# EAGLE design micromouse_v2 (EAGLE 6.3)
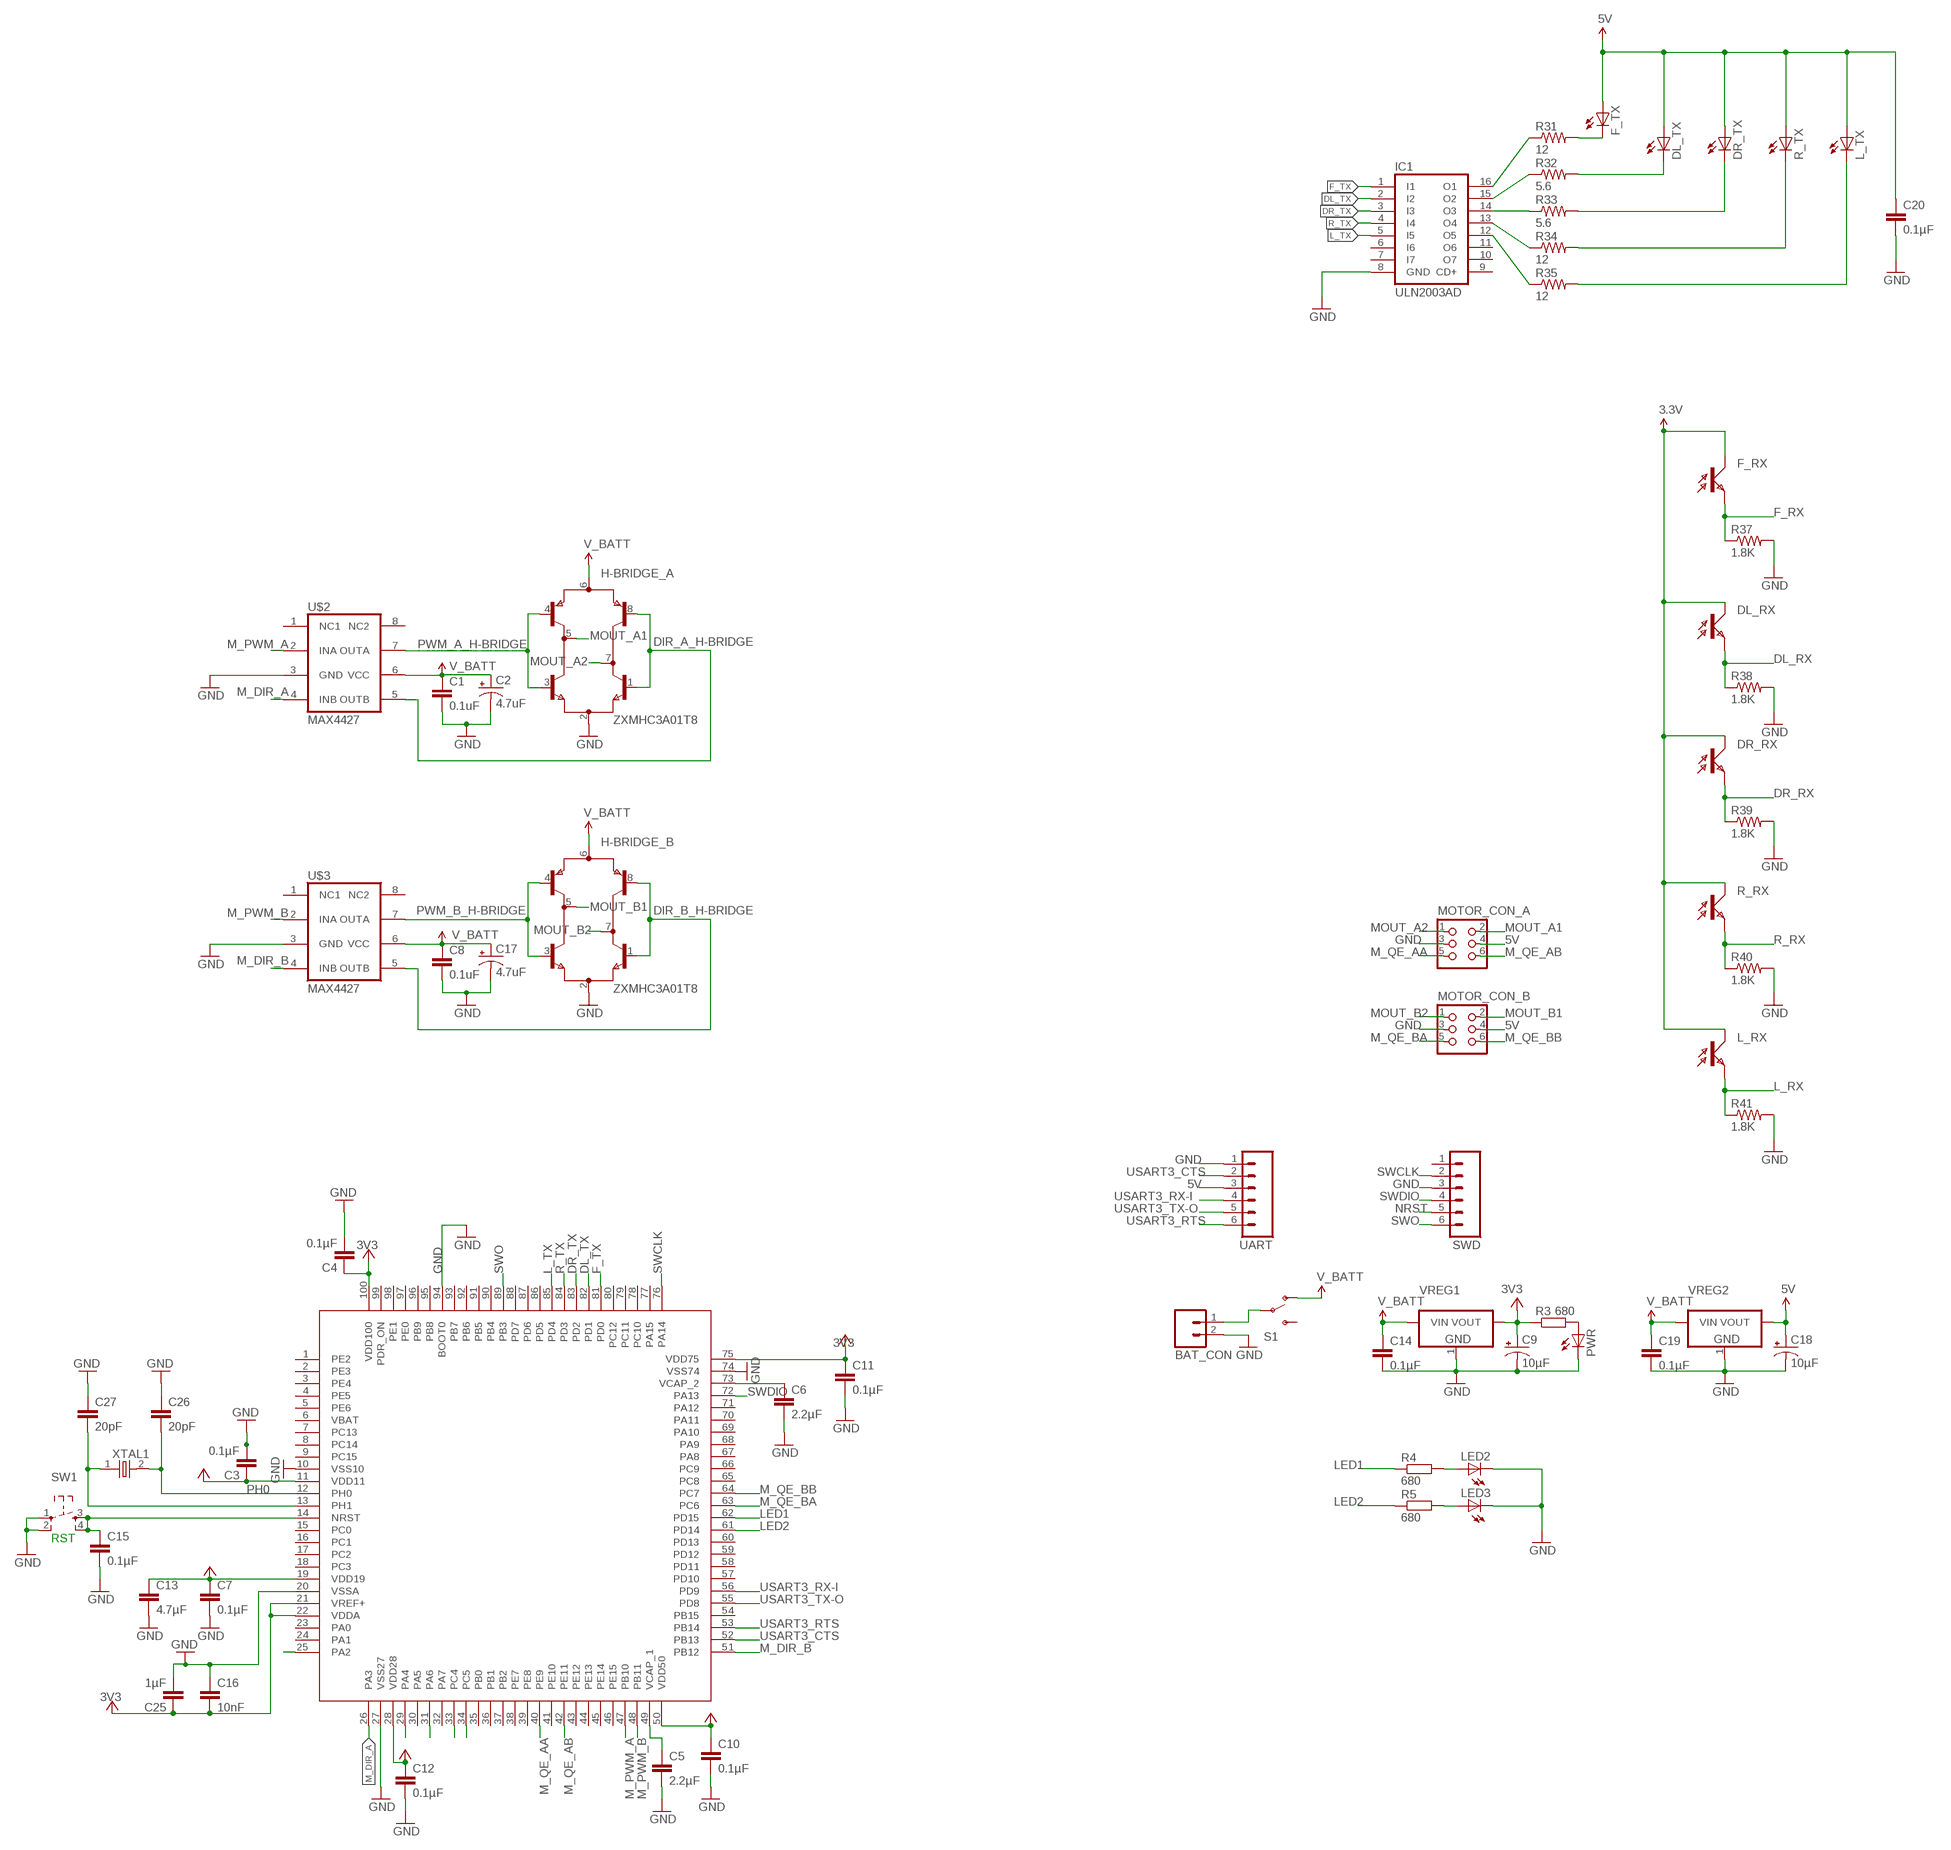
[diagram p0: schematic, sheet 1]

## Parts
BAT_CON  M02LOCK_LONGPADS  [1X02_LOCK_LONGPADS]
C1  0.1uF  CAP1206  [1206]
C2  4.7uF  CAP_POL1206-KIT  [EIA3216-KIT]
C3  0.1µF  CAP1206  [1206]
C4  0.1µF  CAP1206  [1206]
C5  2.2µF  CAP1206  [1206]
C6  2.2µF  CAP1206  [1206]
C7  0.1µF  CAP1206  [1206]
C8  0.1uF  CAP1206  [1206]
C9  10µF  CAP_POL1206  [EIA3216]
C10  0.1µF  CAP1206  [1206]
C11  0.1µF  CAP1206  [1206]
C12  0.1µF  CAP1206  [1206]
C13  4.7µF  CAP1206  [1206]
C14  0.1µF  CAP1206  [1206]
C15  0.1µF  CAP1206  [1206]
C16  10nF  CAP1206  [1206]
C17  4.7uF  CAP_POL1206-KIT  [EIA3216-KIT]
C18  10µF  CAP_POL1206  [EIA3216]
C19  0.1µF  CAP1206  [1206]
C20  0.1µF  CAP1206  [1206]
C25  1µF  CAP1206  [1206]
C26  20pF  CAP1206  [1206]
C27  20pF  CAP1206  [1206]
DL_RX  BPX81  [BPX81]
DL_TX  SFH482  [SFH482]
DR_RX  BPX81  [BPX81]
DR_TX  SFH482  [SFH482]
F_RX  BPX81  [BPX81]
F_TX  SFH482  [SFH482]
H-BRIDGE_A  ZXMHC3A01T8  H-BRIDGE  [SM8]
H-BRIDGE_B  ZXMHC3A01T8  H-BRIDGE  [SM8]
IC1  ULN2003AD  [SO16]
L_RX  BPX81  [BPX81]
L_TX  SFH482  [SFH482]
LED2  LED-FKIT-1206  [FKIT-LED-1206]
LED3  LED-FKIT-1206  [FKIT-LED-1206]
MOTOR_CON_A  CON_HEADER_2X03-PTH  [M2X3]
MOTOR_CON_B  CON_HEADER_2X03-PTH  [M2X3]
PWR  LED-FKIT-1206  [FKIT-LED-1206]
R3  680  RESISTOR-1206  [R1206]
R4  680  RESISTOR-1206  [R1206]
R5  680  RESISTOR-1206  [R1206]
R31  12  RESISTOR1206  [1206]
R32  5.6  RESISTOR1206  [1206]
R33  5.6  RESISTOR1206  [1206]
R34  12  RESISTOR1206  [1206]
R35  12  RESISTOR1206  [1206]
R37  1.8K  RESISTOR1206  [1206]
R38  1.8K  RESISTOR1206  [1206]
R39  1.8K  RESISTOR1206  [1206]
R40  1.8K  RESISTOR1206  [1206]
R41  1.8K  RESISTOR1206  [1206]
R_RX  BPX81  [BPX81]
R_TX  SFH482  [SFH482]
S1  SWITCH-SPDTPTH  [SWITCH-SPDT]
SW1  SW_TACT_4P  [SW_TACT_SMALL]
SWD  M06LOCK  [1X06_LOCK]
U$1  STM32F40X_QFP_PACKAGE  [TQFP-100-14X14MM]
U$2  MAX4427  [SO08]
U$3  MAX4427  [SO08]
UART  M06LOCK  [1X06_LOCK]
VREG1  VREG_3PINS-SOT-223  [SOT-223]
VREG2  VREG_3PINS-SOT-223  [SOT-223]
XTAL1  OSC-XTAL-HC-49U-SMD  [HC-49U]

## Nets
3.3V [low_pwr]: DL_RX.C DR_RX.C F_RX.C L_RX.C R_RX.C
3V3 [low_pwr]: C3.1 C4.1 C7.1 C9.A(+) C10.1 C11.1 C12.1 C13.1 C16.2 C25.1 R3.1 U$1.11(VDD11) U$1.19(VDD19) U$1.21(VREF+) U$1.22(VDDA) U$1.28(VDD28) U$1.50(VDD50) U$1.75(VDD75) U$1.100(VDD100) VREG1.2(VOUT) ; supply symbol labelled SUPPLY_+3V3
5V [low_pwr]: C18.A(+) C20.1 DL_TX.A DR_TX.A F_TX.A L_TX.A MOTOR_CON_A.4 MOTOR_CON_B.4 R_TX.A UART.3 VREG2.2(VOUT)
DIR_A_H-BRIDGE: H-BRIDGE_A.1(B3) H-BRIDGE_A.8(B4) U$2.5(OUTB)
DIR_B_H-BRIDGE: H-BRIDGE_B.1(B3) H-BRIDGE_B.8(B4) U$3.5(OUTB)
DL_RX: DL_RX.E R38.1 U$1.29(PA4)
DL_TX: IC1.2(I2) U$1.82(PD1)
DR_RX: DR_RX.E R39.1 U$1.33(PC4)
DR_TX: IC1.3(I3) U$1.83(PD2)
F_RX: F_RX.E R37.1 U$1.31(PA6)
F_TX: IC1.1(I1) U$1.81(PD0)
GND: BAT_CON.2 C1.2 C2.C(-) C3.2 C4.2 C5.2 C6.2 C7.2 C8.2 C9.C(-) C10.2 C11.2 C12.2 C13.2 C14.2 C15.2 C16.1 C17.C(-) C18.C(-) C19.2 C20.2 C25.2 C26.1 C27.1 H-BRIDGE_A.2(E2E3) H-BRIDGE_B.2(E2E3) IC1.8(GND) LED2.C LED3.C MOTOR_CON_A.3 MOTOR_CON_B.3 PWR.C R37.2 R38.2 R39.2 R40.2 R41.2 SW1.1 SW1.2 SWD.3 U$1.10(VSS10) U$1.20(VSSA) U$1.27(VSS27) U$1.74(VSS74) U$1.94(BOOT0) U$2.3(GND) U$3.3(GND) UART.1 VREG1.1(GND) VREG2.1(GND)
L_RX: L_RX.E R41.1 U$1.25(PA2)
L_TX: IC1.5(I5) U$1.85(PD4)
LED1: R4.1 U$1.62(PD15)
LED2: R5.1 U$1.61(PD14)
M_DIR_A: U$1.26(PA3) U$2.4(INB)
M_DIR_B: U$1.51(PB12) U$3.4(INB)
M_PWM_A: U$1.47(PB10) U$2.2(INA)
M_PWM_B: U$1.48(PB11) U$3.2(INA)
M_QE_AA: MOTOR_CON_A.5 U$1.40(PE9)
M_QE_AB: MOTOR_CON_A.6 U$1.42(PE11)
M_QE_BA: MOTOR_CON_B.5 U$1.63(PC6)
M_QE_BB: MOTOR_CON_B.6 U$1.64(PC7)
MOUT_A1 [PWR_Motors]: H-BRIDGE_A.5(C1C2) MOTOR_CON_A.2
MOUT_A2 [PWR_Motors]: H-BRIDGE_A.7(C3C4) MOTOR_CON_A.1
MOUT_B1 [PWR_Motors]: H-BRIDGE_B.5(C1C2) MOTOR_CON_B.2
MOUT_B2 [PWR_Motors]: H-BRIDGE_B.7(C3C4) MOTOR_CON_B.1
N$1: IC1.16(O1) R31.1
N$2: C6.1 U$1.73(VCAP_2)
N$3: C5.1 U$1.49(VCAP_1)
N$4: PWR.A R3.2
N$5: C27.2 U$1.13(PH1) XTAL1.1
N$6: LED2.A R4.2
N$7: LED3.A R5.2
N$10: IC1.15(O2) R32.1
N$11: IC1.14(O3) R33.1
N$12: IC1.13(O4) R34.1
N$13: IC1.12(O5) R35.1
N$14: F_TX.K(C) R31.2
N$15: DL_TX.K(C) R32.2
N$16 [Power]: BAT_CON.1 S1.2(P)
N$17: R34.2 R_TX.K(C)
N$18: L_TX.K(C) R35.2
N$19: DR_TX.K(C) R33.2
NRST: C15.1 SW1.3 SW1.4 SWD.5 U$1.14(NRST)
PH0: C26.2 U$1.12(PH0) XTAL1.2
PWM_A_H-BRIDGE: H-BRIDGE_A.3(B2) H-BRIDGE_A.4(B1) U$2.7(OUTA)
PWM_B_H-BRIDGE: H-BRIDGE_B.3(B2) H-BRIDGE_B.4(B1) U$3.7(OUTA)
R_RX: R40.1 R_RX.E U$1.34(PC5)
R_TX: IC1.4(I4) U$1.84(PD3)
SWCLK: SWD.2 U$1.76(PA14)
SWDIO: SWD.4 U$1.72(PA13)
SWO: SWD.6 U$1.89(PB3)
USART3_CTS: U$1.52(PB13) UART.2
USART3_RTS: U$1.53(PB14) UART.6
USART3_RX-I: U$1.56(PD9) UART.4
USART3_TX-O: U$1.55(PD8) UART.5
V_BATT [Power]: C1.1 C2.A(+) C8.1 C14.1 C17.A(+) C19.1 H-BRIDGE_A.6(E1E4) H-BRIDGE_B.6(E1E4) S1.1(O) U$2.6(VCC) U$3.6(VCC) VREG1.3(VIN) VREG2.3(VIN)
Unconnected: IC1.6(I6) IC1.7(I7) IC1.9(CD+) IC1.10(O7) IC1.11(O6) S1.3(S) SWD.1 U$1.1(PE2) U$1.2(PE3) U$1.3(PE4) U$1.4(PE5) U$1.5(PE6) U$1.6(VBAT) U$1.7(PC13) U$1.8(PC14) U$1.9(PC15) U$1.15(PC0) U$1.16(PC1) U$1.17(PC2) U$1.18(PC3) U$1.23(PA0) U$1.24(PA1) U$1.30(PA5) U$1.32(PA7) U$1.35(PB0) U$1.36(PB1) U$1.37(PB2) U$1.38(PE7) U$1.39(PE8) U$1.41(PE10) U$1.43(PE12) U$1.44(PE13) U$1.45(PE14) U$1.46(PE15) U$1.54(PB15) U$1.57(PD10) U$1.58(PD11) U$1.59(PD12) U$1.60(PD13) U$1.65(PC8) U$1.66(PC9) U$1.67(PA8) U$1.68(PA9) U$1.69(PA10) U$1.70(PA11) U$1.71(PA12) U$1.77(PA15) U$1.78(PC10) U$1.79(PC11) U$1.80(PC12) U$1.86(PD5) U$1.87(PD6) U$1.88(PD7) U$1.90(PB4) U$1.91(PB5) U$1.92(PB6) U$1.93(PB7) U$1.95(PB8) U$1.96(PB9) U$1.97(PE0) U$1.98(PE1) U$1.99(PDR_ON) U$2.1(NC1) U$2.8(NC2) U$3.1(NC1) U$3.8(NC2)

## Notes on the sheet
- RST

## Library data of the parts
BAT_CON = SparkFun-Connectors:M02: Header 2 Standard 2-pin 0.1" header. Use with straight break away headers (SKU : PRT-00116), right angle break away headers (PRT-00553), swiss pins (PRT-00743), machine pins (PRT-00117), and female headers (PRT-00115). Molex polarized connector foot print use with SKU : PRT-08233 with associated crimp pins and housings.
C1 C3-C8 C10-C16 C19 C20 C25-C27 = SparkFun-Passives:CAP: Capacitor Standard 0603 ceramic capacitor, and 0.1" leaded capacitor.
C2 C9 C17 C18 = SparkFun-Passives:CAP_POL: Capacitor Polarized These are standard SMD and PTH capacitors. Normally 10uF, 47uF, and 100uF in electrolytic and tantalum varieties. Always verify the external diameter of the through hole cap, it varies with capacity, voltage, and manufacturer. The EIA devices should be standard.
DL_RX DR_RX F_RX L_RX R_RX = opto-trans-siemens:BPX81: PHOTO TRANSISTOR; OC_FARNELL: unknown; OC_NEWARK: unknown
DL_TX DR_TX F_TX L_TX R_TX = led:SFH482: IR LED infrared emitting diode, Infineon
H-BRIDGE_A H-BRIDGE_B = zetex:H-BRIDGE: BRIDGE; OC_FARNELL: unknown; OC_NEWARK: unknown
IC1 = uln-udn:ULN2003A: DRIVER ARRAY
LED2 LED3 PWR = SparkFun-LED:LED: LEDs Standard schematic elements and footprints for 5mm, 3mm, 1206, and 0603 sized LEDs. 5mm - Spark Fun Electronics SKU : COM-00529 (and others)
MOTOR_CON_A MOTOR_CON_B = dp_devices:CON_HEADER_2X03
R3-R5 = dp_devices:RESISTOR
R31-R35 R37-R41 = SparkFun-Resistors:RESISTOR: Resistor Basic schematic elements and footprints for 0603, 1206, and PTH resistors.
S1 = SparkFun-Electromechanical:SWITCH-SPDT: SPST Switch Simple slide switch. Spark Fun Electronics SKU : COM-00102
SW1 = dp_devices:SW_TACT_4P
SWD UART = SparkFun-Connectors:M06: Header 6 Standard 6-pin 0.1" header. Use with straight break away headers (SKU : PRT-00116), right angle break away headers (PRT-00553), swiss pins (PRT-00743), machine pins (PRT-00117), and female headers (PRT-00115). Molex polarized connector foot print use with SKU : PRT-08094 with associated crimp pins and housings. NOTES ON THE VARIANTS LOCK and LOCK_LONGPADS... This footprint was designed to help hold the alignment of a through-hole component (i.e. 6-pin header) while soldering it into place. You may notice that each hole has been shifted either up or down by 0.005 of an inch from it's more standard position (which is a perfectly straight line). This slight alteration caused the pins (the squares in the middle) to touch the edges of the holes. Because they are alternating, it causes a "brace" to hold the component in place. 0.005 has proven to be the perfect amount of "off-center" position when using our standard breakaway headers. Although looks a little odd when you look at the bare footprint, once you have a header in there, the alteration is very hard to notice. Also, if you push a header all the way into place, it is covered up entirely on the bottom side. This idea of altering the position of holes to aid alignment will be further integrated into the Sparkfun Library for other footprints. It can help hold any component with 3 or more connection pins.
U$1 = STM32F4:STM32F40X_QFP_PACKAGE
U$2 U$3 = maxim:MAX4427
VREG1 VREG2 = dp_devices:VREG_3PINS: Various 3 pin voltage regulators in different packages Double check the right pinout for the right part
XTAL1 = dp_devices:OSC-XTAL

## Net classes
1 Power: width 0.762 mm, drill 0.508 mm, clearance 0.254 mm
2 PWR_Motors: width 1.016 mm, drill 0.762 mm, clearance 0.254 mm
3 low_pwr: width 0.254 mm, drill 0.381 mm, clearance 0.203 mm

## Board
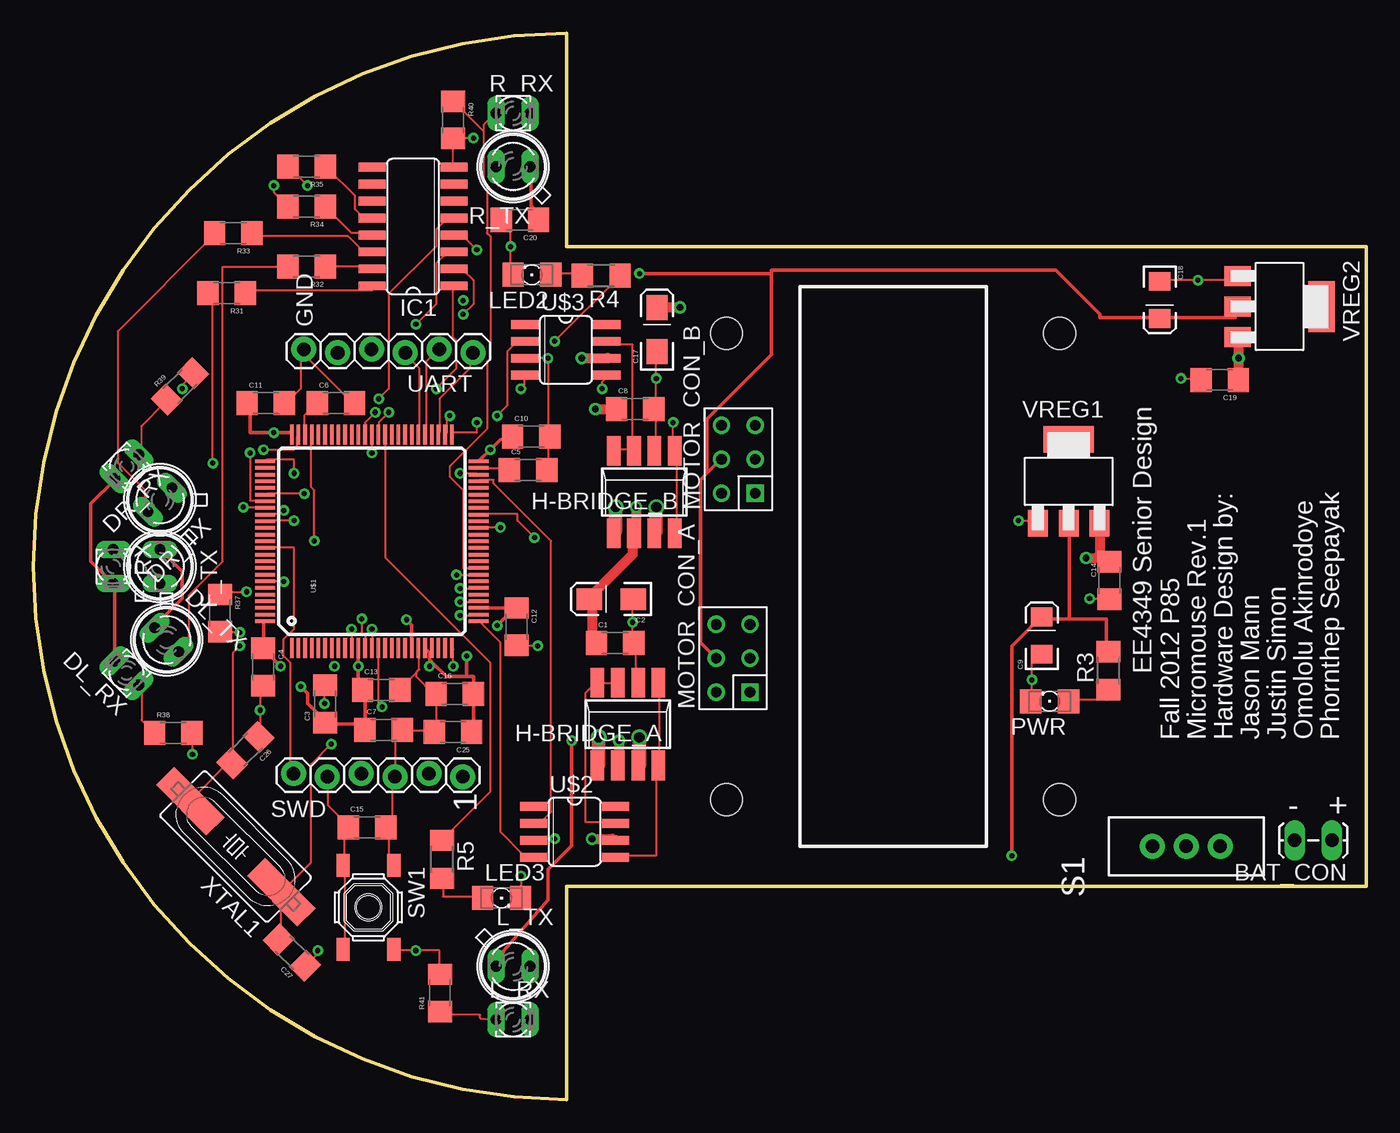
[diagram p1: board, top side]
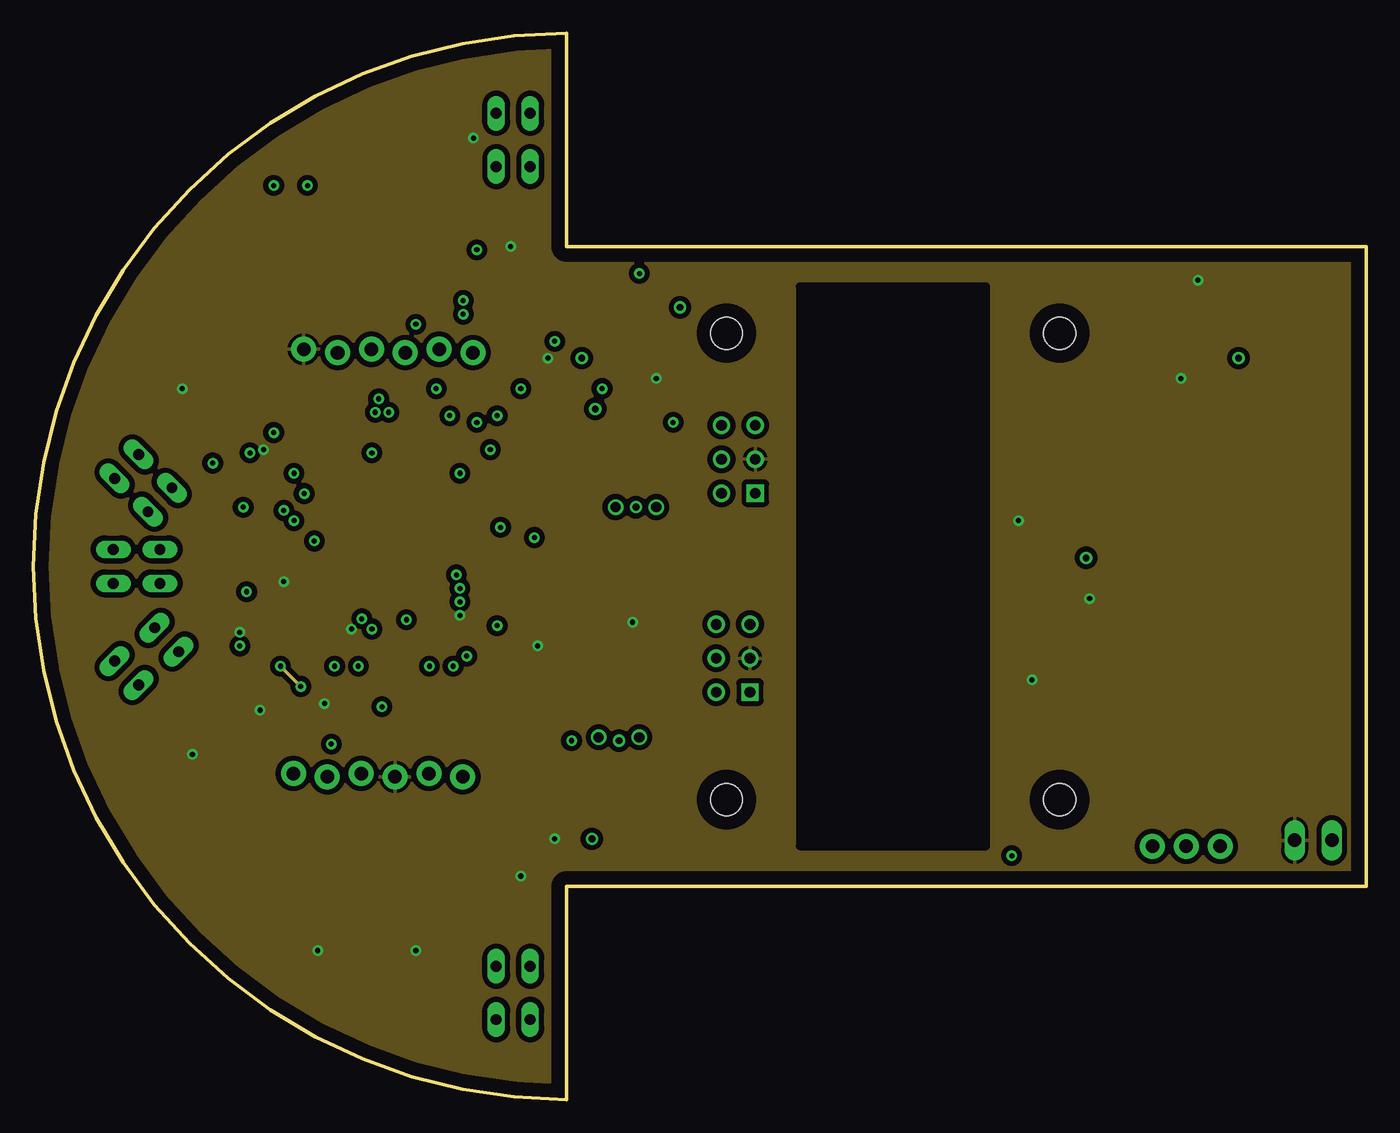
[diagram p2: board, inner layer Route2]
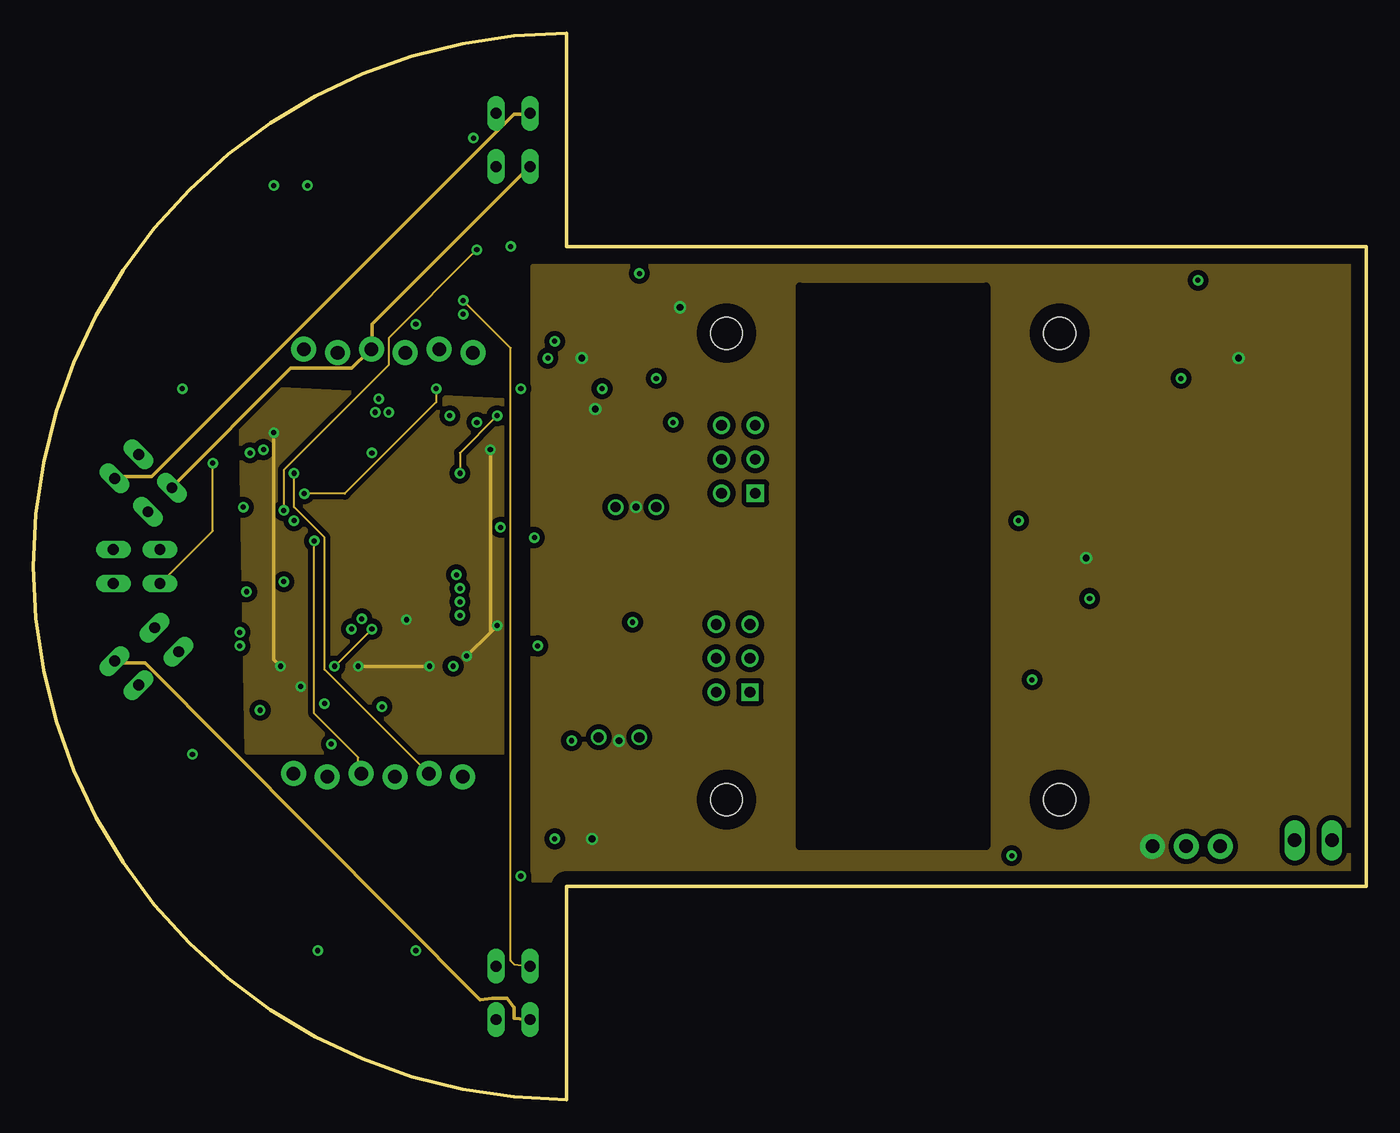
[diagram p3: board, inner layer Route15]
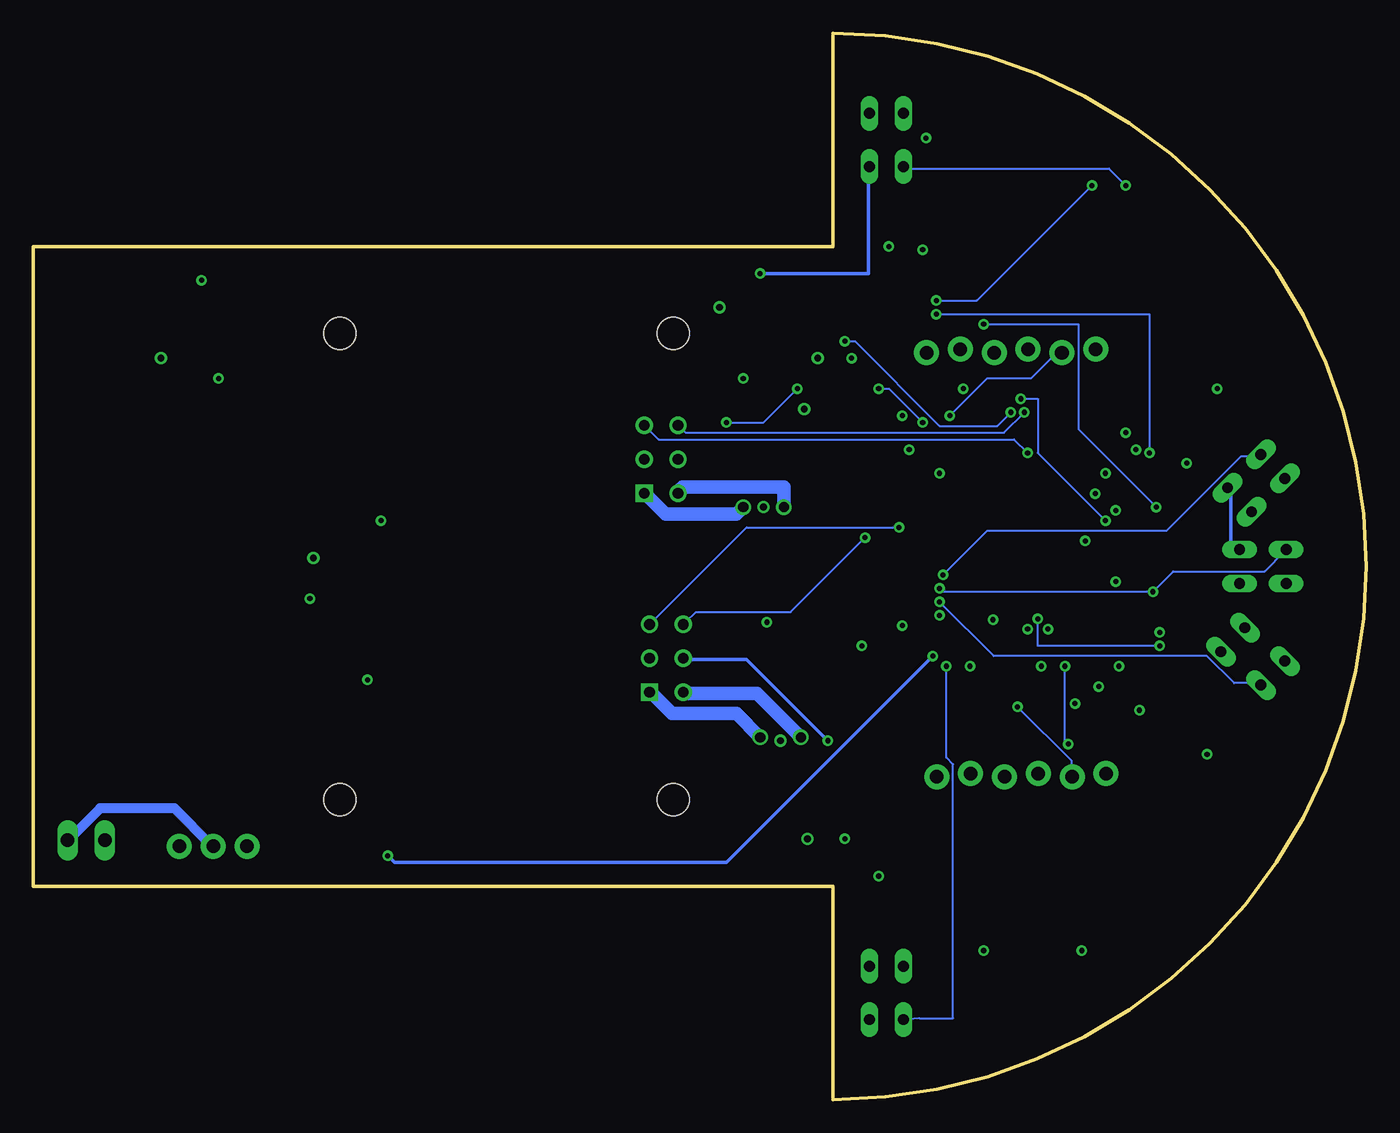
[diagram p4: board, bottom side, seen from below]

Size 100 x 80 mm. Coordinates in mm from the lower left corner, seen from the top.
Outline: 40,0 40,16 100,16 100,64 40,64 40,80 arc180 40,0
Copper layers (1+2*15+16): Top 0.035mm / dielectric 1.5mm / Route2 0.035mm / dielectric 0.15mm / Route15 0.035mm / dielectric 0.2mm / Bottom 0.035mm
Design rules "default *": minimum track width 6mil, minimum drill 15mil, track to track 6mil, track to pad 6mil, pad to pad 6mil, via to via 6mil, smd to smd 6mil, copper to edge 40mil, drill to drill 8mil, minimum pad ring 10mil, minimum via ring 8mil, stop-mask expansion 4mil, vias tented up to drill 20mil, thermal gap 10mil
Holes 2.4 mm at 52,22.5 52,57.5 77,22.5 77,57.5
tRestrict: area 49,19.5 to 55,25.5; area 49,54.5 to 55,60.5; area 74,54.5 to 80,60.5; area 74,19.5 to 80,25.5

### Footprints (pad centres in the part's own frame; a part is rotated, then mirrored left to right if it is on the bottom)
1X02_LOCK_LONGPADS = drill 1.016 long: 1 -0.127,0; 2 2.667,0
1206 = smd 1.6 x 1.8: 1 -1.4,0; 2 1.4,0
EIA3216-KIT = smd 1.9 x 1.6: A 1.65,0; C -1.65,0
EIA3216 = smd 1.4 x 1.6: A 1.4,0; C -1.4,0
BPX81 = drill 0.813 long: C 1.27,0; E -1.27,0
SFH482 = drill 0.813 long: A -1.27,0; K 1.27,0
SM8 = smd 1.016 x 2.235: 1 -2.286,-3.099; 2 -0.762,-3.099; 3 0.762,-3.099; 4 2.286,-3.099; 5 2.286,3.099; 6 0.762,3.099; 7 -0.762,3.099; 8 -2.286,3.099
SO16 = smd 0.66 x 2.032: 1 -4.445,-3.073; 2 -3.175,-3.073; 3 -1.905,-3.073; 4 -0.635,-3.073; 5 0.635,-3.073; 6 1.905,-3.073; 7 3.175,-3.073; 8 4.445,-3.073; 9 4.445,3.073; 10 3.175,3.073; 11 1.905,3.073; 12 0.635,3.073; 13 -0.635,3.073; 14 -1.905,3.073; 15 -3.175,3.073; 16 -4.445,3.073
FKIT-LED-1206 = smd 1.6 x 1.803: A -1.422,0; C 1.422,0
M2X3 = drill 0.8 square: 1 -2.54,-1.27 | drill 0.8: 2 -2.54,1.27; 3 0,-1.27; 4 0,1.27; 5 2.54,-1.27; 6 2.54,1.27
R1206 = smd 1.6 x 1.803: 1 -1.422,0; 2 1.422,0
SWITCH-SPDT = drill 1.016 pad 1.88: 1 0,2.54; 2 0,0; 3 0,-2.54
SW_TACT_SMALL = smd 1.7 x 1: 1 -3.15,1.9; 2 3.15,1.9; 3 -3.15,-1.9; 4 3.15,-1.9
1X06_LOCK = drill 1.016 pad 1.88: 1 0,0; 2 2.54,-0.254; 3 5.08,0; 4 7.62,-0.254; 5 10.16,0; 6 12.7,-0.254
TQFP-100-14X14MM = smd 1.5 x 0.27: 1 -8,6; 2 -8,5.5; 3 -8,5; 4 -8,4.5; 5 -8,4; 6 -8,3.5; 7 -8,3; 8 -8,2.5; 9 -8,2; 10 -8,1.5; 11 -8,1; 12 -8,0.5; 13 -8,0; 14 -8,-0.5; 15 -8,-1; 16 -8,-1.5; 17 -8,-2; 18 -8,-2.5; 19 -8,-3; 20 -8,-3.5; 21 -8,-4; 22 -8,-4.5; 23 -8,-5; 24 -8,-5.5; 25 -8,-6; 51 8,-6; 52 8,-5.5; 53 8,-5; 54 8,-4.5; 55 8,-4; 56 8,-3.5; 57 8,-3; 58 8,-2.5; 59 8,-2; 60 8,-1.5; 61 8,-1; 62 8,-0.5; 63 8,0; 64 8,0.5; 65 8,1; 66 8,1.5; 67 8,2; 68 8,2.5; 69 8,3; 70 8,3.5; 71 8,4; 72 8,4.5; 73 8,5; 74 8,5.5; 75 8,6 | smd 0.27 x 1.5: 26 -6,-8; 27 -5.5,-8; 28 -5,-8; 29 -4.5,-8; 30 -4,-8; 31 -3.5,-8; 32 -3,-8; 33 -2.5,-8; 34 -2,-8; 35 -1.5,-8; 36 -1,-8; 37 -0.5,-8; 38 0,-8; 39 0.5,-8; 40 1,-8; 41 1.5,-8; 42 2,-8; 43 2.5,-8; 44 3,-8; 45 3.5,-8; 46 4,-8; 47 4.5,-8; 48 5,-8; 49 5.5,-8; 50 6,-8; 76 6,8; 77 5.5,8; 78 5,8; 79 4.5,8; 80 4,8; 81 3.5,8; 82 3,8; 83 2.5,8; 84 2,8; 85 1.5,8; 86 1,8; 87 0.5,8; 88 0,8; 89 -0.5,8; 90 -1,8; 91 -1.5,8; 92 -2,8; 93 -2.5,8; 94 -3,8; 95 -3.5,8; 96 -4,8; 97 -4.5,8; 98 -5,8; 99 -5.5,8; 100 -6,8
SO08 = smd 0.66 x 2.032: 1 -1.905,-3.073; 2 -0.635,-3.073; 3 0.635,-3.073; 4 1.905,-3.073; 5 1.905,3.073; 6 0.635,3.073; 7 -0.635,3.073; 8 -1.905,3.073
SOT-223 = smd 1.5 x 2: 1 -2.3,-3.15; 2 0,-3.15; 3 2.3,-3.15 | smd 3.8 x 2: 4 0,3.15
HC-49U = smd 5.334 x 1.93: 1 -4.826,0; 2 4.826,0

### Placement (x,y rotation side)
BAT_CON  97.3,19.45 180 top
C1  43.65,34.26 0 top
C2  43.35,37.55 180 top
C3  21.91,29.68 90 top
C4  17.24,32.46 270 top
C5  37.12,47.24 0 top
C6  22.7,52.24 0 top
C7  26.28,27.74 0 top
C8  45.15,51.82 0 top
C9  75.65,34.81 90 top
C10  37.36,49.74 0 top
C11  17.44,52.24 0 top
C12  36.24,35.48 270 top
C13  26.1,30.74 0 top
C14  80.72,38.94 270 top
C15  25.04,20.43 0 top
C16  31.62,30.43 0 top
C17  46.79,57.77 90 top
C18  84.5,60 270 top
C19  89,54 180 top
C20  36.5,66 180 top
C25  31.48,27.57 180 top
C26  15.92,26.22 225 top
C27  19.4,11.01 135 top
DL_RX  7,32 135 top
DL_TX  10,34.5 315 top
DR_RX  7,47.5 225 top
DR_TX  9.5,45 225 top
F_RX  6,40 270 top
F_TX  9.5,40 270 top
H-BRIDGE_A  44.61,28.17 180 top
H-BRIDGE_B  45.83,45.58 180 top
IC1  28.5,65.5 90 top
L_RX  36,6 0 top
L_TX  36,10 0 top
LED2  37.41,61.88 180 top
LED3  35.13,15.12 0 top
MOTOR_CON_A  52.5,33.11 90 top
MOTOR_CON_B  52.9,48.04 90 top
PWR  76.25,29.88 180 top
R3  80.67,32.18 270 top
R4  42.6,61.83 180 top
R5  30.67,18.02 270 top
R31  14.5,60.5 180 top
R32  20.5,62.5 180 top
R33  15,65 180 top
R34  20.5,67 180 top
R35  20.5,70 180 top
R37  14,36.5 270 top
R38  10.5,27.5 0 top
R39  11,53.5 45 top
R40  31.5,73.5 270 top
R41  30.5,8 90 top
R_RX  36,74 0 top
R_TX  36,70 180 top
S1  86.5,19 90 top
SW1  25.14,14.42 270 top
SWD  32.22,24.21 180 top
U$1  25.39,41.89 90 top
U$2  40.61,20.08 270 top
U$3  39.95,56.25 270 top
UART  20.29,56.29 0 top
VREG1  77.68,46.38 0 top
VREG2  93.5,59.5 270 top
XTAL1  15.18,18.98 135 top

### Tracks (layer width: path | path; a pad name or v marks a point on that pad's centre or on a via)
3.3V
  Top 0.254: DL_RX.C 6.1,33.02 6.1,38.61 F_RX.C 5.84,38.86 4.32,40.39 4.32,44.7 6.1,46.48 DR_RX.C
  Route15 0.254: L_RX.C 36.07,6.1 36.07,6.93 36,7 35.55,7.6 34.4,7.6 33.5,7.5 8.38,32.77 6.35,32.77 DL_RX.C | R_RX.C 37.08,73.91 36.07,73.91 8.89,46.74 6.35,46.74 DR_RX.C
3V3  (via drill 0.38)
  Top 0.254: U$1.75 19.3,50.04 v18.03,50.04 16.26,50.04 16.26,52.07 C11.1 | U$1.100 17.27,35.81 17.27,34.04 C4.1 17.27,33.78 v18.54,32.51 | U$1.11 24.38,33.78 v24.38,32.51 24.38,31.24 24.64,30.99 C13.1 24.89,30.73 24.89,28.19 | 24.89,28.19 24.89,27.94 C7.1 24.89,28.19 | 24.89,28.19 22.1,28.19 C3.1 21.84,28.45 20.57,29.72 20.57,30.48 v20.07,30.99 | 77.72,36.07 80.52,36.07 80.52,33.78 R3.1 | 77.72,36.07 75.69,36.07 C9.A 75.44,36.07 73.41,34.04 v73.41,18.29 | 77.72,36.07 77.72,43.18 VREG1.2 | U$1.50 33.53,48.01 v34.29,48.77 35.05,49.53 35.81,49.53 C10.1 | 29.72,33.53 29.46,33.78 U$1.21 | 29.72,33.53 29.72,33.02 29.97,32.77 | 29.97,32.77 30.99,31.75 32.51,31.75 | 32.51,31.75 33.02,31.75 C16.2 33.02,27.69 C25.1 | v34.8,35.56 36.07,36.83 C12.1 U$1.28 | 32.51,31.75 v32.51,33.27 | 29.97,32.77 v29.72,32.51 | U$1.22 29.89,33.7 29.72,33.53 | U$1.19 28.39,35.61 v28,36
  Route2 0.254: v20.07,30.99 v18.54,32.51
  Route15 0.254: v18.03,50.04 18.03,33.02 v18.54,32.51 | v32.51,33.27 34.29,35.05 | 34.29,35.05 v34.8,35.56 | 34.29,35.05 v34.29,48.77 | v29.72,32.51 v24.38,32.51
  Bottom 0.254: v73.41,18.29 72.9,17.78 48.01,17.78 v32.51,33.27
  pour Route15 (isolate 0.381): 15.5,53.5 36,52.5 36.5,26 16,26
5V  (via drill 0.38)
  Top 0.254: DL_TX.A 9.14,35.56 11.18,37.59 11.18,39.62 9.65,41.15 F_TX.A | C20.1 38.35,66.04 37.34,67.06 37.34,69.85 R_TX.A | VREG2.2 90.17,59.44 90.17,58.67 84.58,58.67 C18.A 84.33,58.67 80.01,58.67 80.01,58.93 76.71,62.23 55.37,62.23 55.37,61.98 | 50.55,46.99 51.56,48.01 MOTOR_CON_B.4 | 50.55,46.99 50.04,46.48 50.04,34.29 51.05,33.27 MOTOR_CON_A.4 | v40.39,26.92 40.39,19.05 38.61,17.27 38.61,14.99 35.28,11.16 L_TX.A | 55.37,61.98 55.37,55.88 50.55,51.05 50.55,46.99 | 55.37,61.98 v45.47,61.98
  Route15 0.254: R_TX.A 37.08,69.85 25.4,58.17 25.4,56.39 UART.3 25.15,56.13 23.88,54.86 19.3,54.86 10.41,45.97 DR_TX.A
  Bottom 0.254: DR_TX.A 10.16,45.72 10.16,41.4 9.65,41.4 F_TX.A | v40.39,26.92 46.48,33.02 51.05,33.02 MOTOR_CON_A.4 | v45.47,61.98 37.34,61.98 37.34,69.85 R_TX.A
DIR_A_H-BRIDGE
  Top 0.152: U$2.5 43.69,18.29 46.74,18.29 46.74,24.89 H-BRIDGE_A.8 46.99,25.15 46.99,31.24 H-BRIDGE_A.1
DIR_B_H-BRIDGE  (via drill 0.38)
  Top 0.152: v42.67,53.34 42.67,53.85 42.93,54.1 U$3.5 | v48.01,50.8 48.01,48.77 H-BRIDGE_B.1 48.26,48.51 48.26,42.67 H-BRIDGE_B.8
  Bottom 0.152: v42.67,53.34 45.21,50.8 v48.01,50.8
DL_RX  (via drill 0.38)
  Top 0.152: v32,37.34 33.27,37.34 U$1.29 | R38.1 8.89,27.69 8.13,28.45 8.13,30.99 DL_RX.E
  Bottom 0.152: v32,37.34 27.94,33.27 11.94,33.27 9.91,31.24 8.13,31.24 DL_RX.E
DL_TX  (via drill 0.38)
  Top 0.152: v16.26,48.51 16.26,44.96 17.27,44.96 U$1.82 | v32.26,58.93 33.02,59.69 33.02,61.47 32.26,62.23 31.75,62.23 IC1.2
  Bottom 0.152: v16.26,48.51 16.26,58.93 v32.26,58.93
DR_RX  (via drill 0.38)
  Top 0.152: v31.75,39.37 33.27,39.37 U$1.33 | R39.1 9.91,52.32 8.13,50.55 8.13,48.51 DR_RX.E
  Bottom 0.152: v31.75,39.37 28.45,42.67 14.99,42.67 9.4,48.26 8.13,48.26 DR_RX.E
DR_TX  (via drill 0.38)
  Top 0.152: v15.75,44.45 17.27,44.45 U$1.83 | v28.7,58.17 30.23,59.69 30.23,62.74 30.99,63.5 31.5,63.5 IC1.3
  Bottom 0.152: v15.75,44.45 21.59,50.29 21.59,58.17 v28.7,58.17
F_RX  (via drill 0.38)
  Top 0.152: v32,38.35 33.27,38.35 U$1.31 | v16,38.1 14.22,38.1 R37.1
  Bottom 0.152: v32,38.35 31.75,38.1 v16,38.1 14.48,39.62 7.62,39.62 6.1,41.15 F_RX.E
F_TX  (via drill 0.38)
  Top 0.152: v20.32,45.47 17.53,45.47 U$1.81 | v30.23,53.34 31.75,54.86 31.75,56.9 31.5,57.15 31.5,60.96 IC1.1
  Route15 0.152: v20.32,45.47 23.37,45.47 30.23,52.32 v30.23,53.34
GND  (via drill 0.38)
  Top 0.152: 28.7,32 27.69,30.99 C13.2 | 28.7,32 28.96,32.26 28.96,33.78 U$1.20 | 28.7,32 28.7,31.75 29.97,30.48 C16.1 30.23,30.23 30.23,27.69 C25.2 29.97,27.69 27.69,27.69 C7.2 27.43,27.69 27.18,27.43 27.18,24.38 SWD.3 26.92,24.13 26.92,20.83 26.67,20.57 C15.2 26.67,20.32 26.67,18.03 26.92,17.78 SW1.1 | H-BRIDGE_B.2 46.74,48.77 46.74,51.82 C8.2 46.74,52.07 v46.74,54.1 46.74,55.88 C17.C | H-BRIDGE_A.2 45.21,31.5 45.21,34.04 C1.2 44.96,34.29 v44.96,35.81 44.96,37.34 C2.C | C18.C 84.58,61.47 v87.38,61.47 90.17,61.47 90.17,61.72 VREG2.1 | SW1.2 27.18,11.18 v28.7,11.18 30.48,11.18 30.48,9.65 R41.2 | C20.2 35.81,65.79 v35.81,64.01 35.81,61.98 LED2.C | C26.1 17.02,27.43 v17.02,29.21 17.02,30.99 C4.2 | C9.C 75.44,33.27 74.93,32.77 v74.93,31.5 74.93,29.97 PWR.C | C5.2 38.61,47.24 38.61,49.53 C10.2 38.61,49.78 v38.61,55.63 37.08,55.63 U$3.3 | 31.75,69.85 IC1.8 31.5,70.1 31.5,71.88 R40.2 31.75,72.14 v33.02,72.14 | v23.88,35.31 23.88,34.04 U$1.10 | v32,36.32 33.27,36.32 U$1.27 | v18.8,38.86 17.53,38.86 U$1.94 | v17.27,48.77 19.56,48.77 19.81,49.02 19.81,49.78 U$1.74 | v21.34,11.18 21.34,10.92 20.57,10.16 C27.1 | v11.94,25.91 11.94,27.43 R38.2 | v21.84,29.72 21.84,30.99 C3.2 | v37.85,34.04 36.32,34.04 C12.2 | v15.49,35.05 14.22,35.05 R37.2 | C11.2 19.05,52.32 20.07,53.34 20.07,56.13 UART.1 20.32,56.13 20.32,55.88 23.88,52.32 C6.2 | v79.25,37.59 80.52,37.59 C14.2 | v86.11,54.1 87.38,54.1 C19.2 | v11.18,53.34 11.18,53.59 11.94,54.36 R39.2 | v36.58,16.76 36.58,15.24 LED3.C | v73.91,43.43 75.18,43.43 VREG1.1 | v39.12,19.56 37.59,19.56 U$2.3
  pour Route2 (isolate 0.381, rank 2): 0,0 100,0 100,80 0,80
L_RX  (via drill 0.38)
  Top 0.152: v31.5,32.51 31.5,33.78 U$1.25 | R41.1 30.73,6.35 33.53,6.35 33.53,6.1 L_RX.E
  Bottom 0.152: v31.5,32.51 31.5,25.65 30.99,25.15 30.99,6.1 33.53,6.1 L_RX.E
L_TX  (via drill 0.38)
  Top 0.152: v19.56,43.43 17.53,43.43 U$1.85 | v25.91,52.58 26.67,53.34 26.67,60.45 30.23,64.01 30.23,65.28 30.99,66.04 31.5,66.04 IC1.5
  Bottom 0.152: v19.56,43.43 24.64,48.51 24.64,52.58 v25.91,52.58
LED1  (via drill 0.38)
  Top 0.152: v26.67,51.56 25.91,50.8 25.91,50.04 U$1.62 | v39.12,56.9 43.94,61.72 R4.1
  Bottom 0.152: v26.67,51.56 27.69,50.55 32,50.55 38.35,56.9 v39.12,56.9
LED2
  Top 0.152: U$1.61 26.42,49.78 26.42,40.64 34.29,32.77 34.29,23.11 30.73,19.56 R5.1
M_DIR_A
  Top 0.152: U$1.26 33.53,35.81 35.05,34.29 35.05,20.07 36.83,18.29 37.34,18.29 U$2.4
M_DIR_B  (via drill 0.38)
  Top 0.152: v33.27,50.8 33.27,50.04 31.5,50.04 U$1.51 | v36.58,53.34 36.83,53.59 36.83,54.1 U$3.4
  Bottom 0.152: v33.27,50.8 35.81,53.34 v36.58,53.34
M_PWM_A
  Top 0.152: U$1.47 33.53,46.48 34.54,46.48 34.54,46.23 38.86,41.91 38.86,21.59 38.1,20.83 37.59,20.83 U$2.2
M_PWM_B  (via drill 0.38)
  Top 0.152: v32,46.99 33.27,46.99 U$1.48 | v34.8,51.31 35.56,52.07 35.56,56.13 36.07,56.64 36.83,56.64 U$3.2
  Route15 0.152: v32,46.99 32,48.51 v34.8,51.31
M_QE_AA  (via drill 0.38)
  Top 0.152: v35.05,42.93 33.53,42.93 U$1.40
  Bottom 0.152: v35.05,42.93 46.48,42.93 53.59,35.81 MOTOR_CON_A.5
M_QE_AB  (via drill 0.38)
  Top 0.152: v37.59,42.16 36.32,43.43 36.32,43.94 33.53,43.94 U$1.42
  Bottom 0.152: v37.59,42.16 43.18,36.58 50.29,36.58 51.05,35.81 MOTOR_CON_A.6
M_QE_BA  (via drill 0.38)
  Top 0.152: v25.4,48.51 25.4,49.78 U$1.63
  Bottom 0.152: v25.4,48.51 26.42,49.53 53.09,49.53 54.1,50.55 MOTOR_CON_B.5
M_QE_BB  (via drill 0.38)
  Top 0.152: v25.65,51.56 24.89,50.8 24.89,50.04 U$1.64
  Bottom 0.152: v25.65,51.56 27.18,50.04 51.05,50.04 51.56,50.55 MOTOR_CON_B.6
MOUT_A1  (via drill 0.76)
  Top 1.016: v42.42,27.18 42.42,25.15 H-BRIDGE_A.5
  Bottom 1.016: v42.42,27.18 45.72,30.48 51.05,30.48 MOTOR_CON_A.2
MOUT_A2  (via drill 0.76)
  Top 1.016: v45.47,27.18 45.47,25.15 H-BRIDGE_A.7
  Bottom 1.016: v45.47,27.18 47.24,28.96 52.07,28.96 53.59,30.48 MOTOR_CON_A.1
MOUT_B1  (via drill 0.76)
  Top 1.016: v43.69,44.45 43.69,42.67 H-BRIDGE_B.5
  Bottom 1.016: v43.69,44.45 43.69,45.97 51.31,45.97 51.56,45.72 MOTOR_CON_B.2
MOUT_B2  (via drill 0.76)
  Top 1.016: v46.74,44.45 46.74,42.67 H-BRIDGE_B.7
  Bottom 1.016: v46.74,44.45 47.24,43.94 52.58,43.94 54.1,45.47 MOTOR_CON_B.1
N$1
  Top 0.152: R31.1 16,60.71 25.4,60.71 25.4,60.96 IC1.16
N$2
  Top 0.152: U$1.73 20.32,50.04 20.32,51.31 21.08,52.07 C6.1
N$3
  Top 0.152: U$1.49 35.57,47.39 C5.1
N$4
  Top 0.152: PWR.A 77.72,29.97 80.52,29.97 80.52,30.73 R3.2
N$5  (via drill 0.38)
  Top 0.152: v25.4,35.31 25.4,34.04 U$1.13 | C27.2 18.54,12.19 18.54,15.49 XTAL1.1 18.8,15.75 20.83,17.78 20.83,25.15 v22.35,26.67
  Route15 0.152: v22.61,32.51 v25.4,35.31
  Bottom 0.152: v22.61,32.51 22.61,26.67 v22.35,26.67
N$6
  Top 0.152: LED2.A 38.86,61.98 41.15,61.98 R4.2
N$7
  Top 0.152: LED3.A 33.53,15.24 30.73,15.24 30.73,16.51 R5.2
N$8
  cutout Route2 (isolate 0.254): 57.5,19 71.5,19 71.5,61 57.5,61
N$9
  cutout Route15: 57.5,61 71.5,61 71.5,19 57.5,19
N$10
  Top 0.152: R32.1 22.1,62.48 25.4,62.48 IC1.15
N$11
  Top 0.152: R33.1 16.51,64.77 23.62,64.77 24.64,63.75 25.4,63.75 IC1.14
N$12
  Top 0.152: R34.1 23.88,65.02 25.4,65.02 IC1.13
N$13
  Top 0.152: R35.1 22.1,69.85 24.13,67.82 24.13,66.8 24.64,66.29 25.4,66.29 IC1.12
N$14  (via drill 0.38)
  Top 0.152: v13.46,47.75 13.46,60.2 13.21,60.45 R31.2
  Route15 0.152: v13.46,47.75 13.46,42.67 9.65,38.86 F_TX.K
N$15
  Top 0.152: R32.2 19.05,62.48 14.22,62.48 14.22,40.39 11.68,37.85 11.68,34.54 10.92,33.78 DL_TX.K
N$16
  Bottom 0.762: BAT_CON.1 97.28,19.56 95,21.84 89.41,21.84 86.61,19.05 S1.2
N$17  (via drill 0.38)
  Top 0.152: v18.03,68.58 18.03,68.07 19.05,67.06 R34.2
  Bottom 0.152: v18.03,68.58 19.3,69.85 34.54,69.85 R_TX.K
N$18  (via drill 0.38)
  Top 0.152: v20.57,68.58 19.3,69.85 R35.2
  Route15 0.152: v32.26,59.94 35.81,56.39 35.81,10.41 36.07,10.16 L_TX.K
  Bottom 0.152: v20.57,68.58 29.21,59.94 v32.26,59.94
N$19
  Top 0.152: R33.2 13.46,64.77 6.35,57.66 6.35,47.75 8.38,45.72 8.38,44.2 DR_TX.K
NRST  (via drill 0.38)
  Top 0.152: SW1.4 23.37,11.43 23.37,17.53 SW1.3 23.37,17.78 23.37,20.07 23.62,20.32 C15.1 23.62,20.57 22.1,22.1 22.1,24.13 SWD.5 | v26.16,29.46 25.91,29.72 25.91,33.78 U$1.14
  Bottom 0.152: v26.16,29.46 22.1,25.4 22.1,24.38 SWD.5
PH0  (via drill 0.38)
  Top 0.152: v24.64,36.07 24.64,35.05 24.89,34.8 24.89,34.04 U$1.12 | v15.49,34.04 14.99,33.53 14.99,25.4 C26.2 14.73,25.4 11.94,22.61 XTAL1.2
  Bottom 0.152: v24.64,36.07 24.64,34.04 v15.49,34.04
PWM_A_H-BRIDGE
  Top 0.152: U$2.7 43.43,20.83 41.4,20.83 41.4,30.48 42.16,31.24 H-BRIDGE_A.4 42.42,31.24 43.69,31.24 H-BRIDGE_A.3
PWM_B_H-BRIDGE
  Top 0.152: 44.96,48.77 44.96,56.64 43.18,56.64 U$3.7 | 44.96,48.77 43.69,48.77 H-BRIDGE_B.4 | 44.96,48.77 H-BRIDGE_B.3
R_RX
  Top 0.152: 33.78,72.64 33.78,73.15 34.54,73.91 R_RX.E | 33.78,72.64 33.78,68.83 34.04,68.58 34.04,65.02 34.29,64.77 34.29,55.63 34.04,55.37 34.04,50.29 31.24,47.5 31.24,46.74 32.26,45.72 32.26,39.88 33.27,39.88 U$1.34 | 33.78,72.64 31.75,74.68 R40.1
R_TX  (via drill 0.38)
  Top 0.152: v18.8,44.2 18.8,43.94 17.53,43.94 U$1.84 | v33.27,63.75 32.26,64.77 31.75,64.77 IC1.4
  Route15 0.152: v18.8,44.2 18.8,47.24 26.67,55.12 26.67,57.15 v33.27,63.75
SWCLK  (via drill 0.38)
  Top 0.152: v19.56,46.99 19.56,48.01 17.53,48.01 U$1.76
  Route15 0.152: v19.56,46.99 19.56,44.45 21.84,42.16 21.84,32.26 29.46,24.64 SWD.2
SWDIO  (via drill 0.38)
  Top 0.152: v21.08,41.91 21.08,45.72 20.83,45.97 20.83,49.78 U$1.72
  Route15 0.152: v21.08,41.91 21.08,28.96 24.38,25.65 24.38,24.64 SWD.4
SWO
  Top 0.152: U$1.89 17.53,41.4 19.56,41.4 19.56,35.31 18.8,34.54 18.8,33.27 19.3,32.77 19.3,24.64 SWD.6
USART3_CTS  (via drill 0.38)
  Top 0.152: v31.24,51.31 30.99,51.05 30.99,50.04 U$1.52
  Bottom 0.152: v31.24,51.31 28.45,54.1 25.15,54.1 23.37,55.88 22.86,55.88 UART.2
USART3_RTS
  Top 0.152: U$1.53 30.48,50.04 30.48,52.58 32.77,54.86 32.77,55.88 UART.6
USART3_RX-I
  Top 0.152: U$1.56 28.96,50.04 28.96,54.86 27.94,55.88 UART.4
USART3_TX-O
  Top 0.152: U$1.55 29.46,50.04 29.46,55.37 30.23,56.13 UART.5
V_BATT  (via drill 0.51)
  Top 0.762: C1.1 42.16,34.29 41.91,34.54 41.91,37.34 C2.A 41.91,37.85 44.96,40.89 44.96,42.16 H-BRIDGE_B.6 45.21,42.67 v45.21,44.45 | 80.01,40.89 80.52,40.39 C14.1 | 80.01,40.89 80.01,43.18 VREG1.3 | C19.1 90.42,54.1 v90.42,55.63 90.42,57.15 VREG2.3 | 43.18,55.63 U$3.6 42.67,55.63 v41.15,55.63 | v42.16,51.82 43.69,51.82 C8.1 | v48.51,59.44 46.99,59.44 C17.A | v41.91,19.56 43.43,19.56 U$2.6 | v43.94,26.92 43.94,25.15 H-BRIDGE_A.6 | v78.99,40.64 79.76,40.64 80.01,40.89
  pour Route15 (isolate 0.381, no thermals): 37.5,62.5 100,62.5 100,16.5 37.5,16.5

### Text on the board
tPlace: GND | EE4349 Senior Design | Fall 2012 P85 | Micromouse Rev.1 | Hardware Design by: | Jason Mann | Justin Simon | Omololu Akinrodoye | Phornthep Seepayak | 1 | - | +